# Altium schematic sheet Terra_main.SchDoc
size A3; Author: Швецов С.В.; Organization: PapuaSoft; SheetNumber: 1; SheetTotal: 8
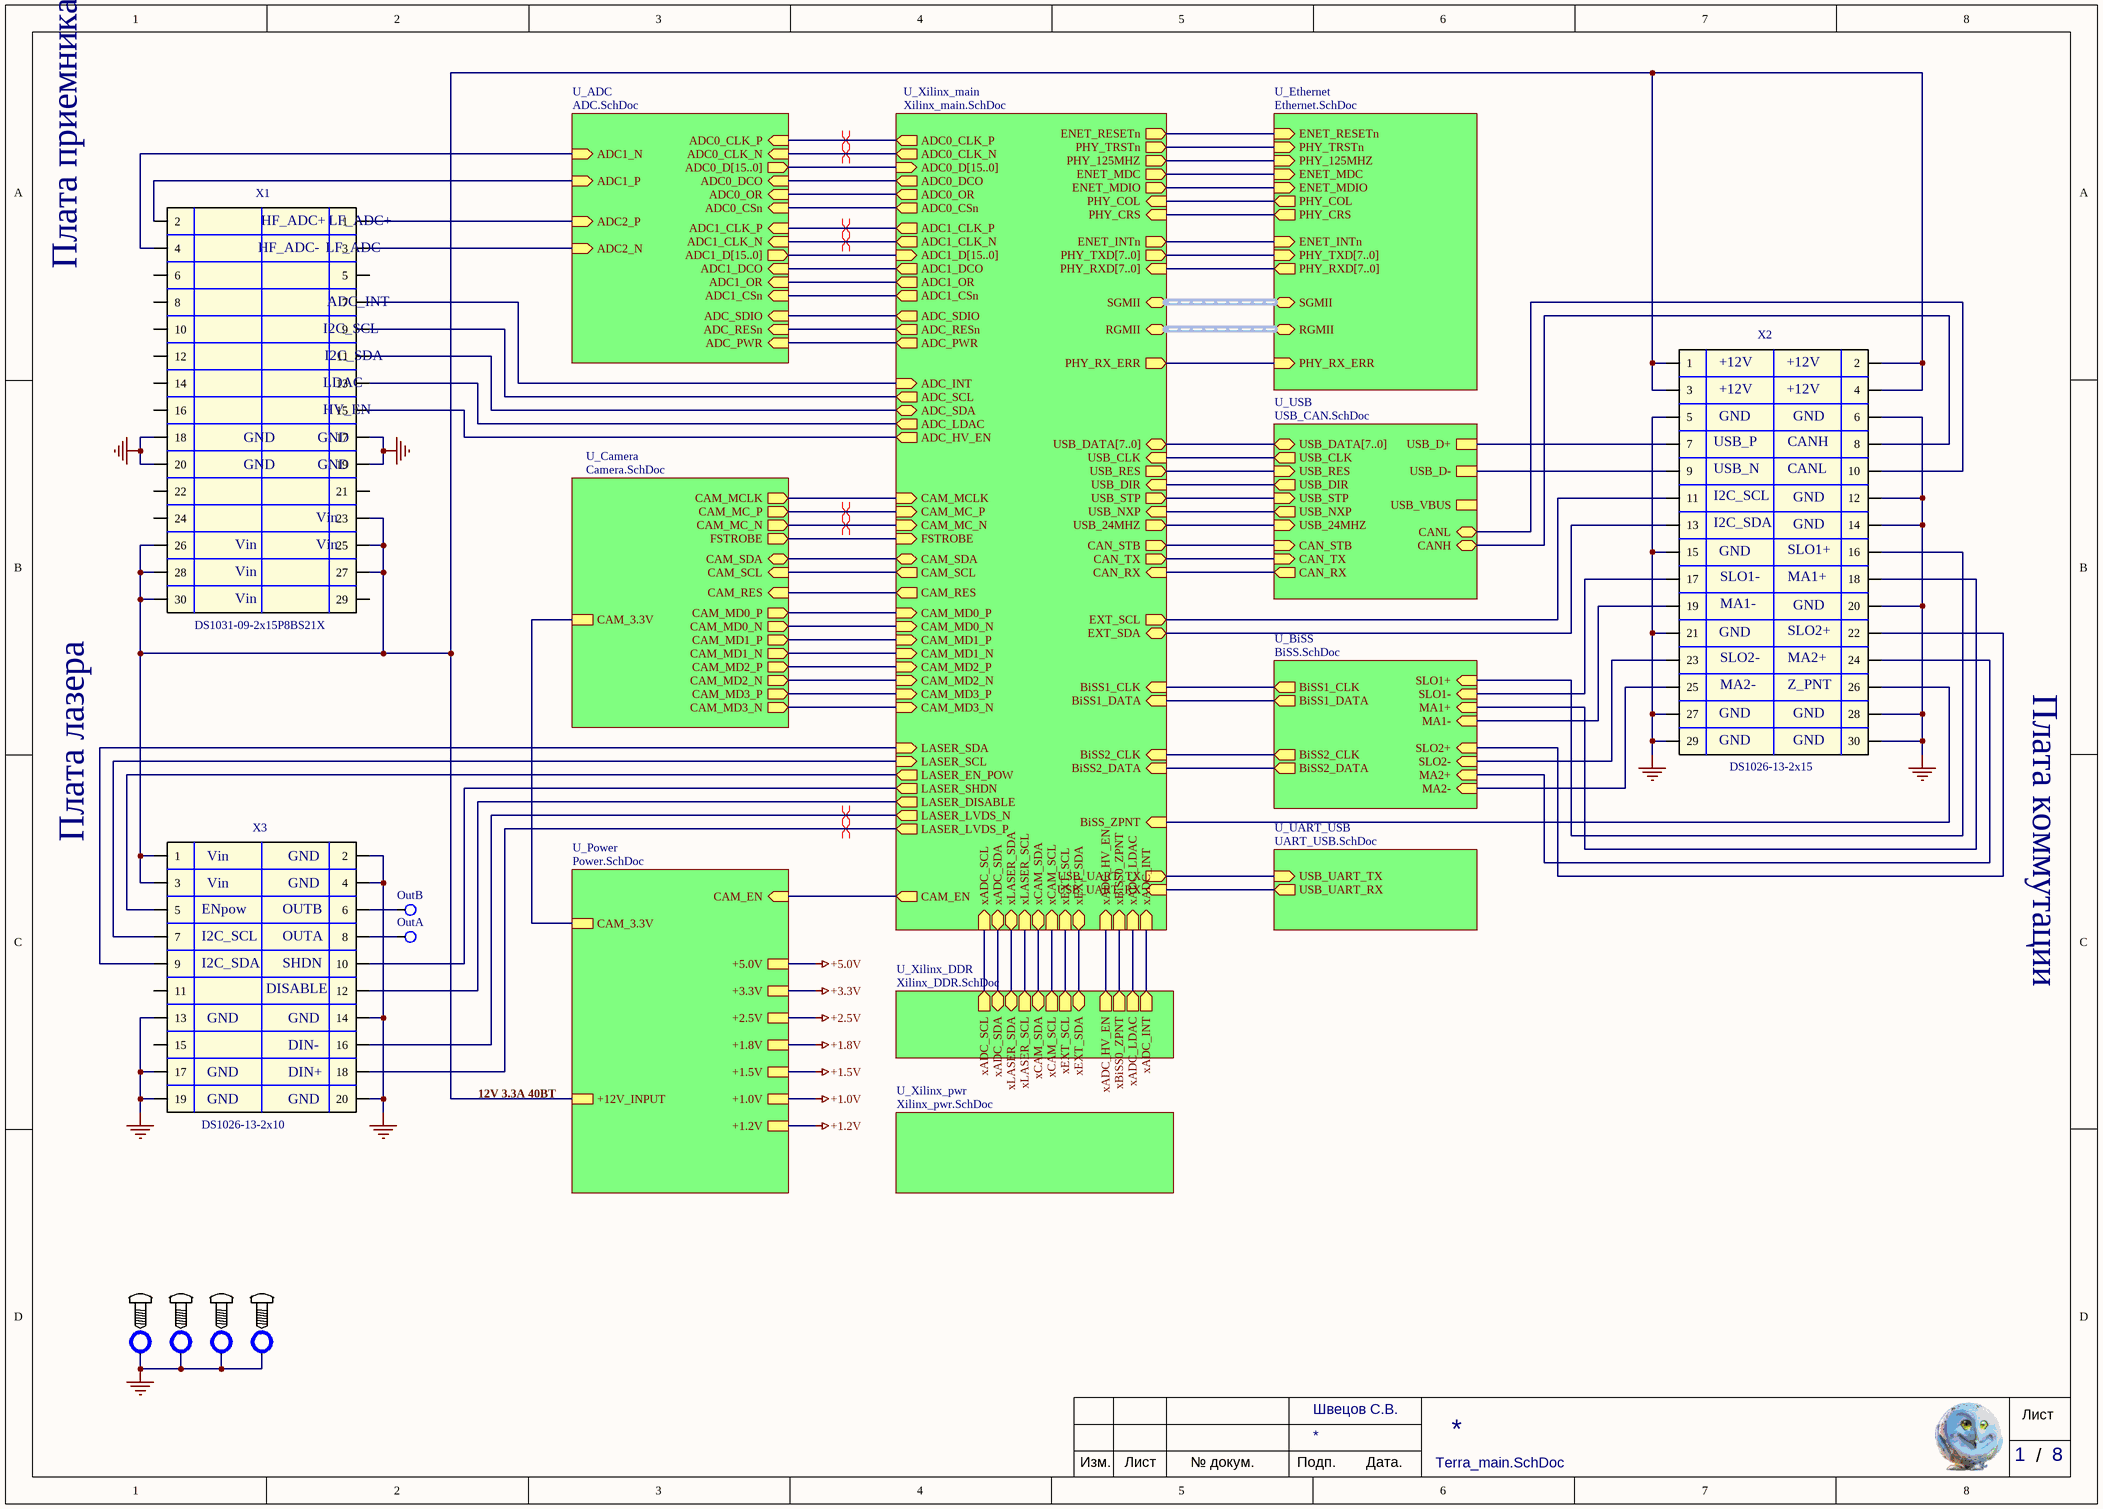
[diagram p0: Terra_main.SchDoc]

## Parts
DRL1  Drill  [Drill 3.2]  (value not drawn)  (no BOM)
DRL2  Drill  [Drill 3.2]  (value not drawn)  (no BOM)
DRL3  Drill  [Drill 3.2]  (value not drawn)  (no BOM)
DRL4  Drill  [Drill 3.2]  (value not drawn)  (no BOM)
TP5  MarkPCB: OutB  [TP_0MM5_1MM0]  (no BOM)
TP6  MarkPCB: OutA  [TP_0MM5_1MM0]  (no BOM)
X1  DS1031-09-2x15P8BS21X  [DS1031-09-2x15]
X2  DS1026-13-2x15  [DS1026-13-2x15]
X3  value DS1026-13-2x10  [DS1026-13-2x10]  (hidden comment: DS1031-09-2x10P8BS21X)

## Sub-sheets
U_ADC = ADC.SchDoc: ADC0_CLK_N (in), ADC0_CLK_P (in), ADC1_CLK_N (in), ADC1_CLK_P (in), ADC0_D[15..0] (out), ADC1_D[15..0] (out), ADC1_P (in), ADC1_N (in), ADC2_P (in), ADC2_N (in), ADC_RESn (in), ADC0_CSn (in), ADC_SDIO (in), ADC_PWR (in), ADC1_CSn (in), ADC0_OR (in), ADC0_DCO (in), ADC1_OR (in), ADC1_DCO (in)
U_BiSS = BiSS.SchDoc: BiSS1_CLK (out), BiSS1_DATA (out), BiSS2_CLK (out), BiSS2_DATA (out), SLO1+ (in), SLO1- (in), MA1- (in), MA1+ (in), SLO2+ (in), SLO2- (in), MA2- (in), MA2+ (in)
U_Camera = Camera.SchDoc: CAM_SCL (in), CAM_SDA (bidir), CAM_MCLK (out), CAM_RES (in), CAM_3.3V, CAM_MC_P (out), CAM_MC_N (out), FSTROBE (out), CAM_MD3_N (out), CAM_MD3_P (out), CAM_MD2_N (out), CAM_MD2_P (out), CAM_MD1_N (out), CAM_MD1_P (out), CAM_MD0_N (out), CAM_MD0_P (out)
U_Ethernet = Ethernet.SchDoc: ENET_RESETn (in), PHY_TRSTn (in), PHY_125MHZ (in), ENET_MDC (in), ENET_MDIO (in), PHY_COL (out), PHY_CRS (out), SGMII (bidir), ENET_INTn (in), PHY_TXD[7..0] (in), PHY_RXD[7..0] (out), RGMII (bidir), PHY_RX_ERR (in)
U_Power = Power.SchDoc: +1.0V, +1.8V, +1.5V, +12V_INPUT, CAM_EN (in), CAM_3.3V, +3.3V, +5.0V, +2.5V, +1.2V
U_UART_USB = UART_USB.SchDoc: USB_UART_TX (in), USB_UART_RX (out)
U_USB = USB_CAN.SchDoc: USB_DATA[7..0] (bidir), USB_CLK (out), USB_NXP (out), USB_DIR (out), USB_STP (in), USB_RES (in), CAN_TX (in), CAN_RX (out), CAN_STB (in), CANH (bidir), CANL (bidir), USB_VBUS, USB_D-, USB_D+, USB_24MHZ (in)
U_Xilinx_DDR = Xilinx_DDR.SchDoc: xADC_SCL (out), xADC_SDA (bidir), xLASER_SDA (bidir), xLASER_SCL (out), xCAM_SDA (bidir), xCAM_SCL (out), xEXT_SCL (out), xEXT_SDA (bidir), xADC_HV_EN (out), xBiSS0_ZPNT (out), xADC_LDAC (out), xADC_INT (out)
U_Xilinx_main = Xilinx_main.SchDoc: ADC_SDA (bidir), ADC_SCL (out), CAM_EN (out), USB_CLK (in), USB_DIR (in), USB_RES (out), USB_DATA[7..0] (bidir), USB_STP (out), USB_NXP (in), BiSS1_CLK (in), BiSS1_DATA (in), BiSS_ZPNT (in), BiSS2_CLK (in), BiSS2_DATA (in), LASER_SHDN (out), LASER_DISABLE (out), LASER_EN_POW (out), LASER_LVDS_N (out), LASER_SDA (in), LASER_SCL (in), LASER_LVDS_P (out), USB_UART_RX (in), USB_UART_TX (out), CAN_STB (out), CAN_RX (in), CAN_TX (out), ADC_INT (in), ADC_LDAC (out), ADC_HV_EN (out), USB_24MHZ (out), ADC0_CLK_P (out), ADC0_CLK_N (out), ADC0_DCO (out), ADC0_OR (out), ADC0_CSn (out), ADC1_CLK_P (out), ADC1_CLK_N (out), ADC1_DCO (out), ADC1_OR (out), ADC1_CSn (out), ADC_SDIO (out), ADC_RESn (out), ADC_PWR (out), ADC0_D[15..0] (in), ADC1_D[15..0] (in), ENET_RESETn (out), PHY_TRSTn (out), PHY_125MHZ (out), ENET_MDC (out), ENET_MDIO (out), PHY_COL (in), PHY_CRS (in), ENET_INTn (out), PHY_RX_ERR (out), PHY_TXD[7..0] (out), PHY_RXD[7..0] (in), EXT_SDA (bidir), EXT_SCL (out), CAM_MCLK (in), CAM_MC_P (in), CAM_MC_N (in), FSTROBE (in), CAM_SDA (bidir), CAM_SCL (out), CAM_RES (out), CAM_MD3_N (in), CAM_MD3_P (in), CAM_MD2_N (in), CAM_MD2_P (in), CAM_MD1_N (in), CAM_MD1_P (in), CAM_MD0_N (in), CAM_MD0_P (in), xLASER_SDA (bidir), xLASER_SCL (in), xCAM_SDA (bidir), xCAM_SCL (in), xEXT_SDA (bidir), xEXT_SCL (in), xADC_SDA (bidir), xADC_SCL (in), xADC_HV_EN (in), xBiSS0_ZPNT (in), xADC_LDAC (in), xADC_INT (in), SGMII (bidir), RGMII (bidir)
U_Xilinx_pwr = Xilinx_pwr.SchDoc: no entries

## Nets
+1.0V: sheet U_Power/+1.0V
+1.2V: sheet U_Power/+1.2V
+1.5V: sheet U_Power/+1.5V
+1.8V: sheet U_Power/+1.8V
+2.5V: sheet U_Power/+2.5V
+3.3V: sheet U_Power/+3.3V
+5.0V: sheet U_Power/+5.0V
GND: DRL1.1 DRL2.1 DRL3.1 DRL4.1 X1.17 X1.18 X1.19 X1.20 X2.5 X2.6 X2.12 X2.14 X2.15 X2.20 X2.21 X2.27 X2.28 X2.29 X2.30 X3.2 X3.4 X3.13 X3.14 X3.17 X3.19 X3.20
NetTP5_1: TP5.1(e1) X3.6
NetTP6_1: TP6.1(e1) X3.8
NetX1_1: X1.1 ; sheet U_ADC/ADC2_P
NetX1_2: X1.2 ; sheet U_ADC/ADC1_P
NetX1_3: X1.3 ; sheet U_ADC/ADC2_N
NetX1_4: X1.4 ; sheet U_ADC/ADC1_N
NetX1_7: X1.7 ; sheet U_Xilinx_main/ADC_INT
NetX1_9: X1.9 ; sheet U_Xilinx_main/ADC_SCL
NetX1_11: X1.11 ; sheet U_Xilinx_main/ADC_SDA
NetX1_13: X1.13 ; sheet U_Xilinx_main/ADC_LDAC
NetX1_15: X1.15 ; sheet U_Xilinx_main/ADC_HV_EN
NetX1_23: X1.23 X1.25 X1.26 X1.27 X1.28 X1.30 X2.1 X2.2 X2.3 X2.4 X3.1 X3.3 ; sheet U_Power/+12V_INPUT
NetX2_7: X2.7 ; sheet U_USB/USB_D+
NetX2_8: X2.8 ; sheet U_USB/CANH
NetX2_9: X2.9 ; sheet U_USB/USB_D-
NetX2_10: X2.10 ; sheet U_USB/CANL
NetX2_11: X2.11 ; sheet U_Xilinx_main/EXT_SCL
NetX2_13: X2.13 ; sheet U_Xilinx_main/EXT_SDA
NetX2_16: X2.16 ; sheet U_BiSS/SLO1+
NetX2_17: X2.17 ; sheet U_BiSS/SLO1-
NetX2_18: X2.18 ; sheet U_BiSS/MA1+
NetX2_19: X2.19 ; sheet U_BiSS/MA1-
NetX2_22: X2.22 ; sheet U_BiSS/SLO2+
NetX2_23: X2.23 ; sheet U_BiSS/SLO2-
NetX2_24: X2.24 ; sheet U_BiSS/MA2+
NetX2_25: X2.25 ; sheet U_BiSS/MA2-
NetX2_26: X2.26 ; sheet U_Xilinx_main/BiSS_ZPNT
NetX3_5: X3.5 ; sheet U_Xilinx_main/LASER_EN_POW
NetX3_7: X3.7 ; sheet U_Xilinx_main/LASER_SCL
NetX3_9: X3.9 ; sheet U_Xilinx_main/LASER_SDA
NetX3_10: X3.10 ; sheet U_Xilinx_main/LASER_SHDN
NetX3_12: X3.12 ; sheet U_Xilinx_main/LASER_DISABLE
NetX3_16: X3.16 ; sheet U_Xilinx_main/LASER_LVDS_N
NetX3_18: X3.18 ; sheet U_Xilinx_main/LASER_LVDS_P
(unnamed): sheet U_Xilinx_main/CAM_EN, sheet U_Power/CAM_EN
(unnamed): sheet U_Xilinx_main/USB_CLK, sheet U_USB/USB_CLK
(unnamed): sheet U_Xilinx_main/USB_DIR, sheet U_USB/USB_DIR
(unnamed): sheet U_Xilinx_main/USB_RES, sheet U_USB/USB_RES
(unnamed): sheet U_Xilinx_main/USB_STP, sheet U_USB/USB_STP
(unnamed): sheet U_Xilinx_main/USB_NXP, sheet U_USB/USB_NXP
(unnamed): sheet U_Xilinx_main/BiSS1_CLK, sheet U_BiSS/BiSS1_CLK
(unnamed): sheet U_Xilinx_main/BiSS1_DATA, sheet U_BiSS/BiSS1_DATA
(unnamed): sheet U_Xilinx_main/BiSS2_CLK, sheet U_BiSS/BiSS2_CLK
(unnamed): sheet U_Xilinx_main/BiSS2_DATA, sheet U_BiSS/BiSS2_DATA
(unnamed): sheet U_Xilinx_main/USB_UART_RX, sheet U_UART_USB/USB_UART_RX
(unnamed): sheet U_Xilinx_main/USB_UART_TX, sheet U_UART_USB/USB_UART_TX
(unnamed): sheet U_Xilinx_main/CAN_STB, sheet U_USB/CAN_STB
(unnamed): sheet U_Xilinx_main/CAN_RX, sheet U_USB/CAN_RX
(unnamed): sheet U_Xilinx_main/CAN_TX, sheet U_USB/CAN_TX
(unnamed): sheet U_Xilinx_main/USB_24MHZ, sheet U_USB/USB_24MHZ
(unnamed): sheet U_Xilinx_main/ADC0_CLK_P, sheet U_ADC/ADC0_CLK_P
(unnamed): sheet U_Xilinx_main/ADC0_CLK_N, sheet U_ADC/ADC0_CLK_N
(unnamed): sheet U_Xilinx_main/ADC0_DCO, sheet U_ADC/ADC0_DCO
(unnamed): sheet U_Xilinx_main/ADC0_OR, sheet U_ADC/ADC0_OR
(unnamed): sheet U_Xilinx_main/ADC0_CSn, sheet U_ADC/ADC0_CSn
(unnamed): sheet U_Xilinx_main/ADC1_CLK_P, sheet U_ADC/ADC1_CLK_P
(unnamed): sheet U_Xilinx_main/ADC1_CLK_N, sheet U_ADC/ADC1_CLK_N
(unnamed): sheet U_Xilinx_main/ADC1_DCO, sheet U_ADC/ADC1_DCO
(unnamed): sheet U_Xilinx_main/ADC1_OR, sheet U_ADC/ADC1_OR
(unnamed): sheet U_Xilinx_main/ADC1_CSn, sheet U_ADC/ADC1_CSn
(unnamed): sheet U_Xilinx_main/ADC_SDIO, sheet U_ADC/ADC_SDIO
(unnamed): sheet U_Xilinx_main/ADC_RESn, sheet U_ADC/ADC_RESn
(unnamed): sheet U_Xilinx_main/ADC_PWR, sheet U_ADC/ADC_PWR
(unnamed): sheet U_Xilinx_main/ENET_RESETn, sheet U_Ethernet/ENET_RESETn
(unnamed): sheet U_Xilinx_main/PHY_TRSTn, sheet U_Ethernet/PHY_TRSTn
(unnamed): sheet U_Xilinx_main/PHY_125MHZ, sheet U_Ethernet/PHY_125MHZ
(unnamed): sheet U_Xilinx_main/ENET_MDC, sheet U_Ethernet/ENET_MDC
(unnamed): sheet U_Xilinx_main/ENET_MDIO, sheet U_Ethernet/ENET_MDIO
(unnamed): sheet U_Xilinx_main/PHY_COL, sheet U_Ethernet/PHY_COL
(unnamed): sheet U_Xilinx_main/PHY_CRS, sheet U_Ethernet/PHY_CRS
(unnamed): sheet U_Xilinx_main/ENET_INTn, sheet U_Ethernet/ENET_INTn
(unnamed): sheet U_Xilinx_main/PHY_RX_ERR, sheet U_Ethernet/PHY_RX_ERR
(unnamed): sheet U_Xilinx_main/CAM_MCLK, sheet U_Camera/CAM_MCLK
(unnamed): sheet U_Xilinx_main/CAM_MC_P, sheet U_Camera/CAM_MC_P
(unnamed): sheet U_Xilinx_main/CAM_MC_N, sheet U_Camera/CAM_MC_N
(unnamed): sheet U_Xilinx_main/FSTROBE, sheet U_Camera/FSTROBE
(unnamed): sheet U_Xilinx_main/CAM_SDA, sheet U_Camera/CAM_SDA
(unnamed): sheet U_Xilinx_main/CAM_SCL, sheet U_Camera/CAM_SCL
(unnamed): sheet U_Xilinx_main/CAM_RES, sheet U_Camera/CAM_RES
(unnamed): sheet U_Xilinx_main/CAM_MD3_N, sheet U_Camera/CAM_MD3_N
(unnamed): sheet U_Xilinx_main/CAM_MD3_P, sheet U_Camera/CAM_MD3_P
(unnamed): sheet U_Xilinx_main/CAM_MD2_N, sheet U_Camera/CAM_MD2_N
(unnamed): sheet U_Xilinx_main/CAM_MD2_P, sheet U_Camera/CAM_MD2_P
(unnamed): sheet U_Xilinx_main/CAM_MD1_N, sheet U_Camera/CAM_MD1_N
(unnamed): sheet U_Xilinx_main/CAM_MD1_P, sheet U_Camera/CAM_MD1_P
(unnamed): sheet U_Xilinx_main/CAM_MD0_N, sheet U_Camera/CAM_MD0_N
(unnamed): sheet U_Xilinx_main/CAM_MD0_P, sheet U_Camera/CAM_MD0_P
(unnamed): sheet U_Xilinx_main/xLASER_SDA, sheet U_Xilinx_DDR/xLASER_SDA
(unnamed): sheet U_Xilinx_main/xLASER_SCL, sheet U_Xilinx_DDR/xLASER_SCL
(unnamed): sheet U_Xilinx_main/xCAM_SDA, sheet U_Xilinx_DDR/xCAM_SDA
(unnamed): sheet U_Xilinx_main/xCAM_SCL, sheet U_Xilinx_DDR/xCAM_SCL
(unnamed): sheet U_Xilinx_main/xEXT_SDA, sheet U_Xilinx_DDR/xEXT_SDA
(unnamed): sheet U_Xilinx_main/xEXT_SCL, sheet U_Xilinx_DDR/xEXT_SCL
(unnamed): sheet U_Xilinx_main/xADC_SDA, sheet U_Xilinx_DDR/xADC_SDA
(unnamed): sheet U_Xilinx_main/xADC_SCL, sheet U_Xilinx_DDR/xADC_SCL
(unnamed): sheet U_Xilinx_main/xADC_HV_EN, sheet U_Xilinx_DDR/xADC_HV_EN
(unnamed): sheet U_Xilinx_main/xBiSS0_ZPNT, sheet U_Xilinx_DDR/xBiSS0_ZPNT
(unnamed): sheet U_Xilinx_main/xADC_LDAC, sheet U_Xilinx_DDR/xADC_LDAC
(unnamed): sheet U_Xilinx_main/xADC_INT, sheet U_Xilinx_DDR/xADC_INT
(unnamed): sheet U_Power/CAM_3.3V, sheet U_Camera/CAM_3.3V

Not connected (* = marked no-connect by the designer): X1 5 6 8 10 12 14 16 21 22 24 29; X3 11 15

## Buses and harness runs
bus sheet U_ADC/ADC0_D[15..0] = sheet U_Xilinx_main/ADC0_D[15..0]
bus sheet U_ADC/ADC1_D[15..0] = sheet U_Xilinx_main/ADC1_D[15..0]
bus sheet U_Ethernet/PHY_RXD[7..0] = sheet U_Xilinx_main/PHY_RXD[7..0]
bus sheet U_Ethernet/PHY_TXD[7..0] = sheet U_Xilinx_main/PHY_TXD[7..0]
bus sheet U_USB/USB_DATA[7..0] = sheet U_Xilinx_main/USB_DATA[7..0]
harness sheet U_Ethernet/RGMII = sheet U_Xilinx_main/RGMII
harness sheet U_Ethernet/SGMII = sheet U_Xilinx_main/SGMII

## Layout directives
differential pair: (no net found under the mark), NetX3_16, NetX3_18

## Notes on the sheet
- (near X1) HF_ADC+
- (near X1) LF_ADC+
- Плата приемника
- (near X1) HF_ADC-
- (near X1) LF_ADC-
- (near X1) ADC_INT
- (near X1) I2C_SCL
- (near X1) I2C_SDA
- (near X2) +12V
- (near X1) GND
- (near X1) LDAC
- (near X1) HV_EN
- (near X2) USB_P
- (near X2) GND
- (near X2) CANH
- (near X2) I2C_SCL
- (near X2) USB_N
- (near X2) CANL
- (near X1) Vin
- (near X2) I2C_SDA
- (near X2) SLO1-
- (near X2) SLO1+
- (near X2) MA1+
- (near X2) MA1-
- (near X2) SLO2+
- (near X2) SLO2-
- (near X2) MA2-
- (near X2) Z_PNT
- (near X2) MA2+
- Плата коммутации
- Плата лазера
- (near X3) ENpow
- (near X3) Vin
- (near X3) OUTB
- (near X3) GND
- (near X3) I2C_SCL
- (near X3) I2C_SDA
- (near X3) DISABLE
- (near X3) OUTA
- (near X3) SHDN
- (near X3) DIN-
- (near X3) DIN+
- 12V 3.3A 40ВТ
- Лист
- /
- Изм.
- № докум.
- Подп.
- Дата.

## Library data of the parts
DRL1-DRL4 = Drill: Крепёжное отверстие
TP5 TP6 = Test_Point: Тестовая точка на плате
X1 = CON2x15: Штыри 2x15 1.27 мм на плату; Value: DS1031-09-2x15P8BS21X; Parameter 1: *
X2 = CON2x15: Гнезда 2x15 2.0мм угловые на плату; Value: DS1056-10-2x15
X3 = CON2x10: Штыри 2x10  2.0 мм на плату